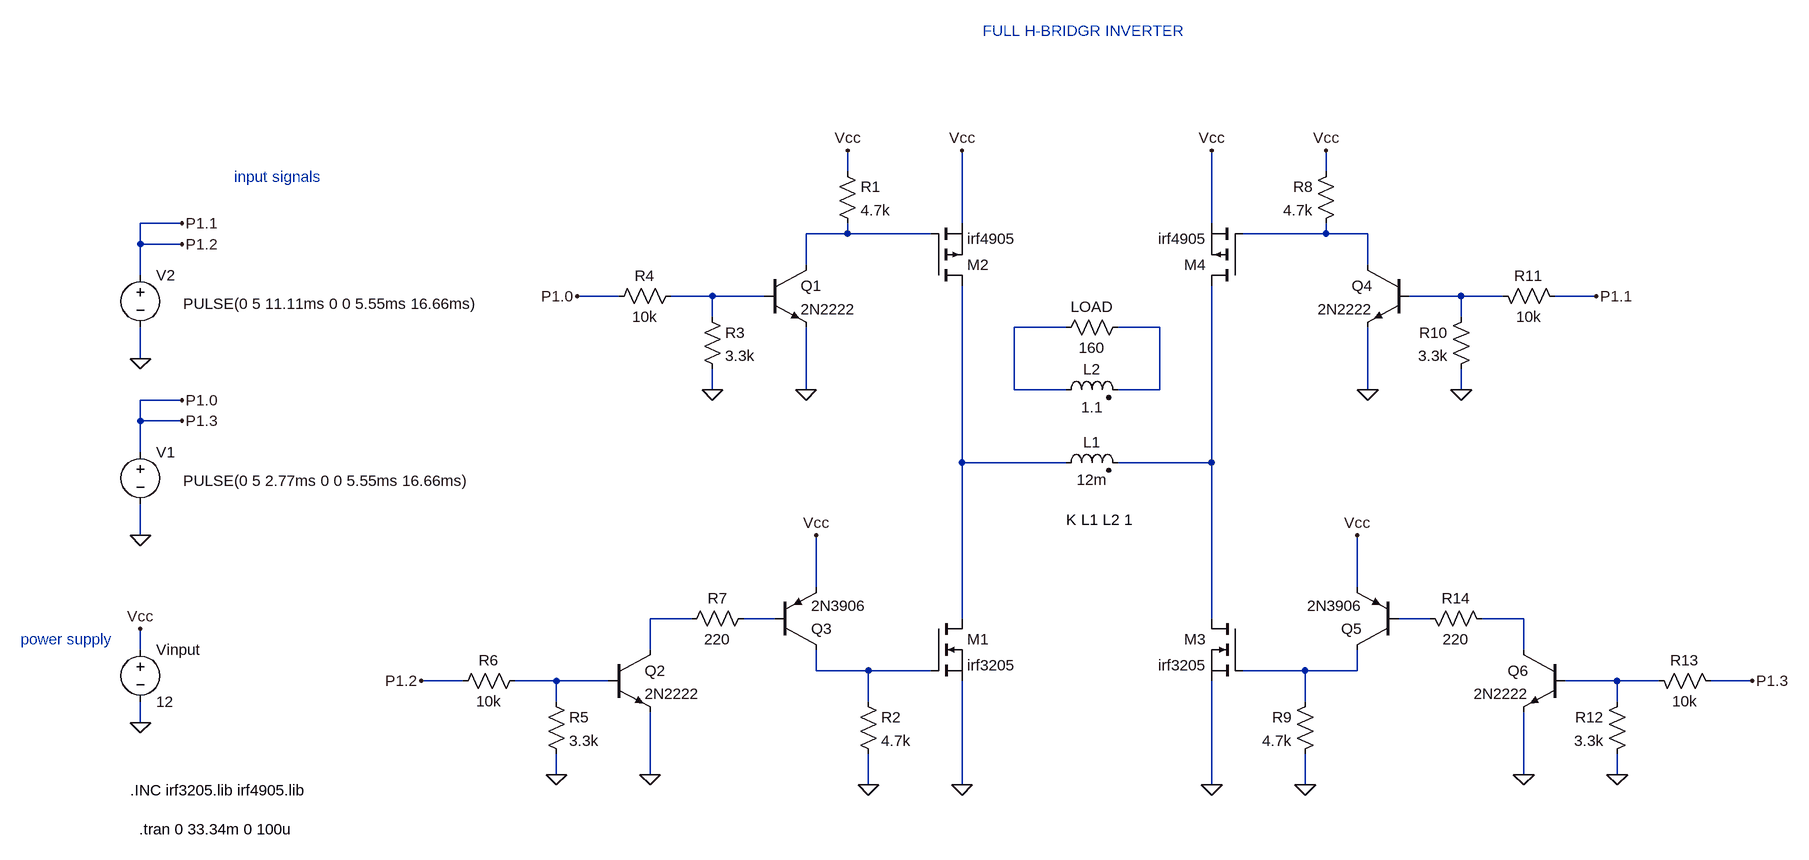
[diagram p0: schematic inverter.asc]
inverter.asc, the LTspice schematic file:
Version 4
SHEET 1 2068 884
WIRE 288 -144 288 -176
WIRE 1024 -144 1024 -176
WIRE -736 -64 -800 -64
WIRE 464 -64 464 -176
WIRE 848 -64 848 -176
WIRE 288 -48 288 -64
WIRE 288 -48 224 -48
WIRE 416 -48 288 -48
WIRE 1024 -48 1024 -64
WIRE 1024 -48 896 -48
WIRE 1088 -48 1024 -48
WIRE -800 -32 -800 -64
WIRE -736 -32 -800 -32
WIRE 224 0 224 -48
WIRE 1088 0 1088 -48
WIRE -800 16 -800 -32
WIRE -64 48 -128 48
WIRE 80 48 16 48
WIRE 160 48 80 48
WIRE 1232 48 1152 48
WIRE 1296 48 1232 48
WIRE 1440 48 1376 48
WIRE 80 80 80 48
WIRE 1232 80 1232 48
WIRE 624 96 544 96
WIRE 768 96 704 96
WIRE -800 144 -800 96
WIRE 80 192 80 160
WIRE 224 192 224 96
WIRE 544 192 544 96
WIRE 624 192 544 192
WIRE 768 192 768 96
WIRE 768 192 704 192
WIRE 1088 192 1088 96
WIRE 1232 192 1232 160
WIRE -736 208 -800 208
WIRE -800 240 -800 208
WIRE -736 240 -800 240
WIRE -800 288 -800 240
WIRE 464 304 464 32
WIRE 624 304 464 304
WIRE 848 304 848 32
WIRE 848 304 704 304
WIRE -800 416 -800 368
WIRE 240 496 240 416
WIRE 1072 496 1072 416
WIRE 48 544 -16 544
WIRE 176 544 128 544
WIRE 464 544 464 304
WIRE 848 544 848 304
WIRE 1184 544 1136 544
WIRE 1328 544 1264 544
WIRE -800 592 -800 560
WIRE -16 592 -16 544
WIRE 1328 592 1328 544
WIRE 240 624 240 592
WIRE 320 624 240 624
WIRE 416 624 320 624
WIRE 992 624 896 624
WIRE 1072 624 1072 592
WIRE 1072 624 992 624
WIRE -304 640 -368 640
WIRE -160 640 -224 640
WIRE -80 640 -160 640
WIRE 1472 640 1392 640
WIRE 1536 640 1472 640
WIRE 1680 640 1616 640
WIRE -160 672 -160 640
WIRE 320 672 320 624
WIRE 992 672 992 624
WIRE 1472 672 1472 640
WIRE -800 704 -800 672
WIRE -160 784 -160 752
WIRE -16 784 -16 688
WIRE 1328 784 1328 688
WIRE 1472 784 1472 752
WIRE 320 800 320 752
WIRE 464 800 464 640
WIRE 848 800 848 640
WIRE 992 800 992 752
FLAG -800 560 Vcc
FLAG -800 704 0
FLAG 80 192 0
FLAG 224 192 0
FLAG 288 -176 Vcc
FLAG 464 -176 Vcc
FLAG -128 48 P1.0
FLAG -160 784 0
FLAG -16 784 0
FLAG -368 640 P1.2
FLAG 240 416 Vcc
FLAG 320 800 0
FLAG 464 800 0
FLAG 1232 192 0
FLAG 1088 192 0
FLAG 1024 -176 Vcc
FLAG 848 -176 Vcc
FLAG 1440 48 P1.1
FLAG 1472 784 0
FLAG 1328 784 0
FLAG 1680 640 P1.3
FLAG 1072 416 Vcc
FLAG 992 800 0
FLAG 848 800 0
FLAG -800 416 0
FLAG -736 208 P1.0
FLAG -736 240 P1.3
FLAG -800 144 0
FLAG -736 -64 P1.1
FLAG -736 -32 P1.2
SYMBOL res 608 112 R270
WINDOW 0 32 56 VTop 2
WINDOW 3 0 56 VBottom 2
SYMATTR InstName LOAD
SYMATTR Value 160
SYMBOL voltage -800 576 R0
WINDOW 123 0 0 Left 2
WINDOW 39 0 0 Left 2
SYMATTR InstName Vinput
SYMATTR Value 12
SYMBOL nmos 416 544 R0
SYMATTR InstName M1
SYMATTR Value irf3205
SYMBOL res 272 -160 R0
SYMATTR InstName R1
SYMATTR Value 4.7k
SYMBOL res 304 656 R0
SYMATTR InstName R2
SYMATTR Value 4.7k
SYMBOL npn2 160 0 R0
SYMATTR InstName Q1
SYMATTR Value 2N2222
SYMBOL res 64 64 R0
SYMATTR InstName R3
SYMATTR Value 3.3k
SYMBOL res -80 64 R270
WINDOW 0 32 56 VTop 2
WINDOW 3 0 56 VBottom 2
SYMATTR InstName R4
SYMATTR Value 10k
SYMBOL pnp 176 592 M180
SYMATTR InstName Q3
SYMATTR Value 2N3906
SYMBOL npn2 -80 592 R0
SYMATTR InstName Q2
SYMATTR Value 2N2222
SYMBOL res -176 656 R0
SYMATTR InstName R5
SYMATTR Value 3.3k
SYMBOL res -320 656 R270
WINDOW 0 32 56 VTop 2
WINDOW 3 0 56 VBottom 2
SYMATTR InstName R6
SYMATTR Value 10k
SYMBOL res 32 560 R270
WINDOW 0 32 56 VTop 2
WINDOW 3 0 56 VBottom 2
SYMATTR InstName R7
SYMATTR Value 220
SYMBOL pmos 896 32 R180
SYMATTR InstName M4
SYMATTR Value irf4905
SYMBOL res 1040 -160 M0
SYMATTR InstName R8
SYMATTR Value 4.7k
SYMBOL res 1008 656 M0
SYMATTR InstName R9
SYMATTR Value 4.7k
SYMBOL npn2 1152 0 M0
SYMATTR InstName Q4
SYMATTR Value 2N2222
SYMBOL res 1248 64 M0
SYMATTR InstName R10
SYMATTR Value 3.3k
SYMBOL res 1392 64 M270
WINDOW 0 32 56 VTop 2
WINDOW 3 0 56 VBottom 2
SYMATTR InstName R11
SYMATTR Value 10k
SYMBOL pnp 1136 592 R180
SYMATTR InstName Q5
SYMATTR Value 2N3906
SYMBOL npn2 1392 592 M0
SYMATTR InstName Q6
SYMATTR Value 2N2222
SYMBOL res 1488 656 M0
SYMATTR InstName R12
SYMATTR Value 3.3k
SYMBOL res 1632 656 M270
WINDOW 0 32 56 VTop 2
WINDOW 3 0 56 VBottom 2
SYMATTR InstName R13
SYMATTR Value 10k
SYMBOL res 1280 560 M270
WINDOW 0 32 56 VTop 2
WINDOW 3 0 56 VBottom 2
SYMATTR InstName R14
SYMATTR Value 220
SYMBOL ind2 608 320 R270
WINDOW 0 32 56 VTop 2
WINDOW 3 5 56 VBottom 2
SYMATTR InstName L1
SYMATTR Value 12m
SYMATTR Type ind
SYMBOL ind2 608 208 R270
WINDOW 0 32 56 VTop 2
WINDOW 3 5 56 VBottom 2
SYMATTR InstName L2
SYMATTR Value 1.1
SYMATTR Type ind
SYMBOL pmos 416 32 M180
SYMATTR InstName M2
SYMATTR Value irf4905
SYMBOL nmos 896 544 M0
SYMATTR InstName M3
SYMATTR Value irf3205
SYMBOL voltage -800 272 R0
WINDOW 3 66 60 Left 2
WINDOW 123 0 0 Left 2
WINDOW 39 0 0 Left 2
SYMATTR InstName V1
SYMATTR Value PULSE(0 5 2.77ms 0 0 5.55ms 16.66ms)
SYMBOL voltage -800 0 R0
WINDOW 3 66 60 Left 2
WINDOW 123 0 0 Left 2
WINDOW 39 0 0 Left 2
SYMATTR InstName V2
SYMATTR Value PULSE(0 5 11.11ms 0 0 5.55ms 16.66ms)
TEXT -816 808 Left 2 !.INC irf3205.lib irf4905.lib
TEXT -984 576 Left 2 ;power supply
TEXT 496 -360 Left 2 ;FULL H-BRIDGR INVERTER
TEXT 624 392 Left 2 !K L1 L2 1
TEXT -656 -136 Left 2 ;input signals
TEXT -802 868 Left 2 !.tran 0 33.34m 0 100u

The netlist it stands for:
* inverter.asc
R§LOAD N005 N006 160
Vinput Vcc 0 12
M1 N007 N013 0 0 irf3205
R1 Vcc N001 4.7k
R2 N013 0 4.7k
Q1 N001 N003 0 0 2N2222
R3 N003 0 3.3k
R4 P1.3 N003 10k
Q3 N013 N010 Vcc 0 2N3906
Q2 N009 N015 0 0 2N2222
R5 N015 0 3.3k
R6 P1.1 N015 10k
R7 N009 N010 220
M4 N008 N002 Vcc Vcc irf4905
R8 Vcc N002 4.7k
R9 N014 0 4.7k
Q4 N002 N004 0 0 2N2222
R10 N004 0 3.3k
R11 P1.1 N004 10k
Q5 N014 N011 Vcc 0 2N3906
Q6 N012 N016 0 0 2N2222
R12 N016 0 3.3k
R13 P1.3 N016 10k
R14 N012 N011 220
L1 N007 N008 12m
L2 N005 N006 1.1
M2 N007 N001 Vcc Vcc irf4905
M3 N008 N014 0 0 irf3205
V1 P1.3 0 PULSE(0 5 2.77ms 0 0 5.55ms 16.66ms)
V2 P1.1 0 PULSE(0 5 11.11ms 0 0 5.55ms 16.66ms)
.model NPN NPN
.model PNP PNP
.lib standard.bjt
.model NMOS NMOS
.model PMOS PMOS
.lib standard.mos
.INC irf3205.lib irf4905.lib
* power supply
* FULL H-BRIDGR INVERTER
K L1 L2 1
* input signals
.tran 0 33.34m 0 100u
.backanno
.end